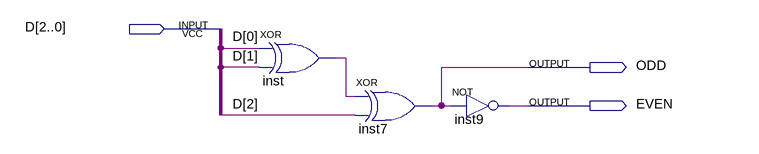
[diagram p0: schematic sheet]
// Quartus schematic Mod2_2b_sch.bdf as structural Verilog: 3 symbols, 3 pins
module Mod2_2b_sch (
  input  [2:0] D,
  output ODD,
  output EVEN
);

  wire inst_out;

  xor inst (inst_out, D[0], D[1]);
  xor inst7 (ODD, inst_out, D[2]);
  not inst9 (EVEN, ODD);
endmodule
